# Altium schematic sheet DUT_Platform.SchDoc
size A4; SheetNumber: 6; SheetTotal: 7
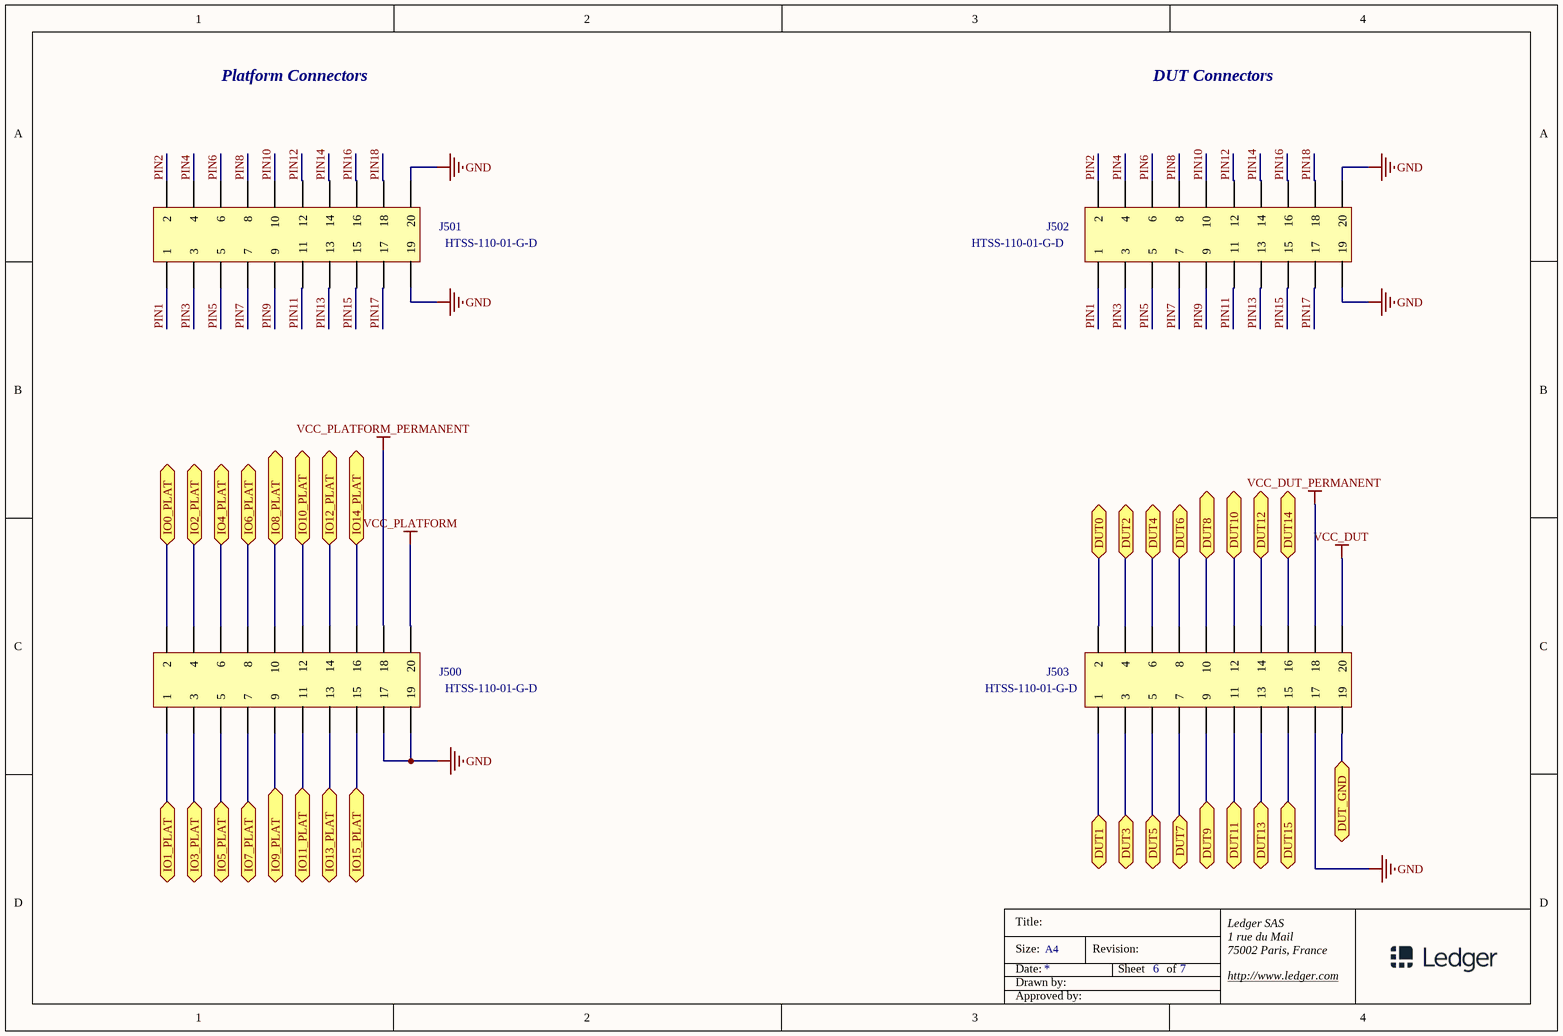
[diagram p0: DUT_Platform.SchDoc]

## Parts
J500  HTSS-110-01-G-D  [SAMTEC_HTSS-110-01-G-D]
J501  HTSS-110-01-G-D  [SAMTEC_HTSS-110-01-G-D]
J502  HTSS-110-01-G-D  [SAMTEC_HTSS-110-01-G-D]
J503  HTSS-110-01-G-D  [SAMTEC_HTSS-110-01-G-D]

## Ports
DUT0, DUT1, DUT2, DUT3, DUT4, DUT5, DUT6, DUT7, DUT8, DUT9, DUT10, DUT11, DUT12, DUT13, DUT14, DUT15, DUT_GND, IO0_PLAT, IO1_PLAT, IO2_PLAT, IO3_PLAT, IO4_PLAT, IO5_PLAT, IO6_PLAT, IO7_PLAT, IO8_PLAT, IO9_PLAT, IO10_PLAT, IO11_PLAT, IO12_PLAT, IO13_PLAT, IO14_PLAT, IO15_PLAT

## Nets
GND: J500.17 J500.19 J501.19 J501.20 J502.19 J502.20 J503.17
VCC_DUT: J503.20
VCC_DUT_PERMANENT: J503.18
VCC_PLATFORM: J500.20
VCC_PLATFORM_PERMANENT: J500.18
DUT0: J503.2 ; port DUT0
DUT1: J503.1 ; port DUT1
DUT2: J503.4 ; port DUT2
DUT3: J503.3 ; port DUT3
DUT4: J503.6 ; port DUT4
DUT5: J503.5 ; port DUT5
DUT6: J503.8 ; port DUT6
DUT7: J503.7 ; port DUT7
DUT8: J503.10 ; port DUT8
DUT9: J503.9 ; port DUT9
DUT10: J503.12 ; port DUT10
DUT11: J503.11 ; port DUT11
DUT12: J503.14 ; port DUT12
DUT13: J503.13 ; port DUT13
DUT14: J503.16 ; port DUT14
DUT15: J503.15 ; port DUT15
DUT_GND: J503.19 ; port DUT_GND
IO0_PLAT: J500.2 ; port IO0_PLAT
IO1_PLAT: J500.1 ; port IO1_PLAT
IO2_PLAT: J500.4 ; port IO2_PLAT
IO3_PLAT: J500.3 ; port IO3_PLAT
IO4_PLAT: J500.6 ; port IO4_PLAT
IO5_PLAT: J500.5 ; port IO5_PLAT
IO6_PLAT: J500.8 ; port IO6_PLAT
IO7_PLAT: J500.7 ; port IO7_PLAT
IO8_PLAT: J500.10 ; port IO8_PLAT
IO9_PLAT: J500.9 ; port IO9_PLAT
IO10_PLAT: J500.12 ; port IO10_PLAT
IO11_PLAT: J500.11 ; port IO11_PLAT
IO12_PLAT: J500.14 ; port IO12_PLAT
IO13_PLAT: J500.13 ; port IO13_PLAT
IO14_PLAT: J500.16 ; port IO14_PLAT
IO15_PLAT: J500.15 ; port IO15_PLAT
PIN1: J501.1 J502.1
PIN2: J501.2 J502.2
PIN3: J501.3 J502.3
PIN4: J501.4 J502.4
PIN5: J501.5 J502.5
PIN6: J501.6 J502.6
PIN7: J501.7 J502.7
PIN8: J501.8 J502.8
PIN9: J501.9 J502.9
PIN10: J501.10 J502.10
PIN11: J501.11 J502.11
PIN12: J501.12 J502.12
PIN13: J501.13 J502.13
PIN14: J501.14 J502.14
PIN15: J501.15 J502.15
PIN16: J501.16 J502.16
PIN17: J501.17 J502.17
PIN18: J501.18 J502.18

## Notes on the sheet
- Platform Connectors
- DUT Connectors
- Title:
- Size:
- Date:
- Drawn by:
- A4
- Revision:
- Sheet
- of
- Ledger SAS
- 1 rue du Mail
- 75002 Paris, France
- http://www.ledger.com
- Approved by:

## Library data of the parts
J500-J503 = Connector - Header - 20 Pins - Dual row - Shrouded - Male: Manufacturer: Samtec; NoPins: 20; Rows: 2; Manufacturer PN: HTSS-110-01-G-D